# EAGLE design CoinCellBreakOutTop (EAGLE 7.2.0)
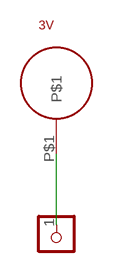
[diagram p0: schematic, sheet 1]

## Parts
3V  COIN_CELL_CONTACT  [COIN_CELL_CONTACT]
TO_GND  CON_HEADER_1X01-PTH_10_17  [M1X2_10_17]

## Nets
N$4 [power]: 3V.P$1 TO_GND.1

## Library data of the parts
3V = CoinCellBreakOut:COIN_CELL_CONTACT
TO_GND = dp_devices:CON_HEADER_1X01

## Net classes
0 default: width 0.254 mm, drill 0.305 mm, clearance 0.127 mm
1 power: width 0.635 mm, drill 0.635 mm, clearance 0.127 mm

## Board
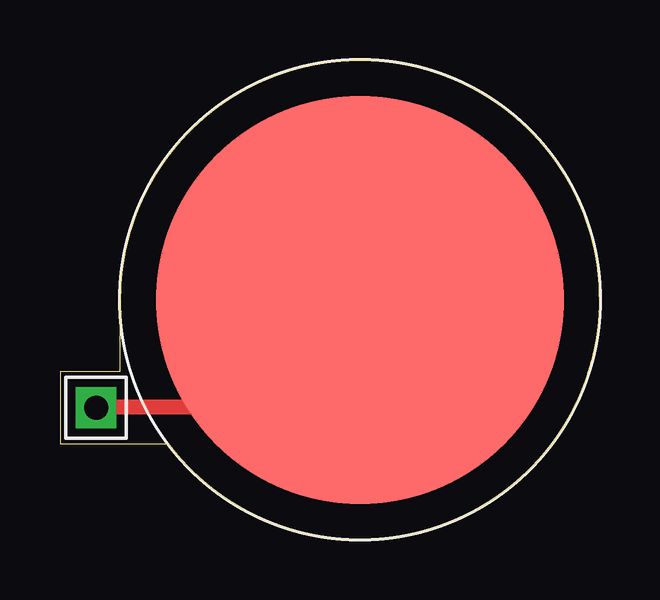
[diagram p1: board, top side]

Size 22.49 x 19.99 mm. Coordinates in mm from the lower left corner, seen from the top.
Outline: 0,4 4.5,4 arc323 2.5,10 2.5,7 0,7 0,4
Copper layers (1*16): Top 0.035mm / dielectric 1.5mm / Bottom 0.035mm
Design rules "dirt_cheap_dirty_boards.v1": minimum track width 5mil, minimum drill 12mil, track to track 5mil, track to pad 5mil, pad to pad 5mil, via to via 5mil, smd to smd 0mil, copper to edge 10mil, drill to drill 10mil, minimum pad ring 10mil, minimum via ring 6mil, stop-mask expansion 2mil, vias tented up to drill 25mil, thermal gap 10mil

### Footprints (pad centres in the part's own frame; a part is rotated, then mirrored left to right if it is on the bottom)
COIN_CELL_CONTACT = smd 17 x 17: P$1 0,0
M1X2_10_17 = drill 1 pad 1.7 square: 1 0,0

### Placement (x,y rotation side)
3V  12.5,10 0 top
TO_GND  1.5,5.5 0 top

### Tracks (layer width: path | path; a pad name or v marks a point on that pad's centre or on a via)
N$4
  Top 0.635: TO_GND.1 1.55,5.52 8.03,5.52 12.41,9.91 3V.P$1